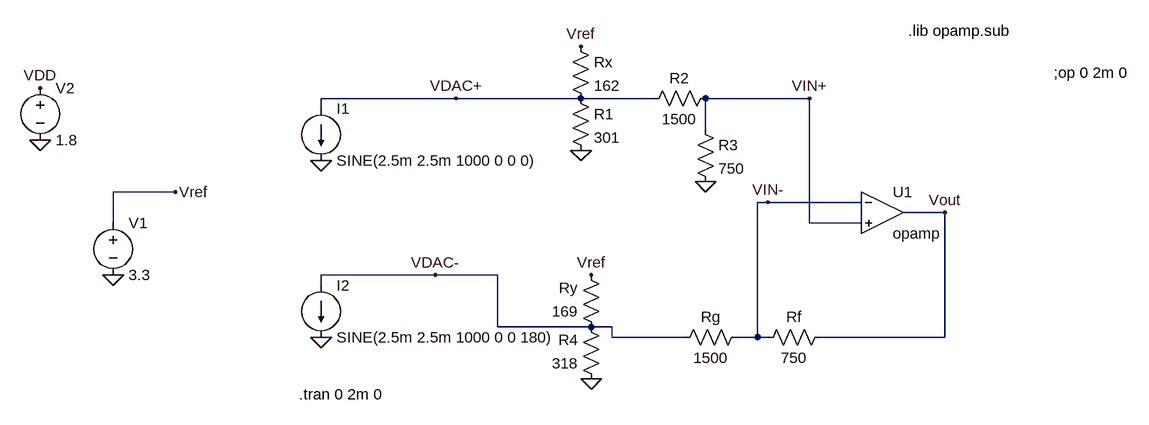
[diagram p0: schematic DAC_Network_Model.asc]
DAC_Network_Model.asc, the LTspice schematic file:
Version 4
SHEET 1 916 680
WIRE -128 16 -336 16
WIRE 64 16 -128 16
WIRE 176 16 64 16
WIRE 416 16 256 16
WIRE -336 32 -336 16
WIRE 256 64 256 16
WIRE -560 160 -656 160
WIRE 352 176 336 176
WIRE 496 176 352 176
WIRE 624 192 560 192
WIRE -656 208 -656 160
WIRE 416 208 416 16
WIRE 496 208 416 208
WIRE -160 288 -336 288
WIRE -64 288 -160 288
WIRE -336 304 -336 288
WIRE -64 368 -64 288
WIRE 80 368 -64 368
WIRE 112 368 80 368
WIRE 112 384 112 368
WIRE 224 384 112 384
WIRE 336 384 336 176
WIRE 336 384 304 384
WIRE 352 384 336 384
WIRE 624 384 624 192
WIRE 624 384 432 384
FLAG 256 144 0
FLAG 64 96 0
FLAG 80 448 0
FLAG -336 112 0
FLAG -336 384 0
FLAG -656 288 0
FLAG 64 -64 Vref
FLAG 80 288 Vref
FLAG -560 160 Vref
FLAG 624 192 Vout
FLAG -128 16 VDAC+
FLAG -160 288 VDAC-
FLAG 416 16 VIN+
FLAG 352 176 VIN-
FLAG -768 80 0
FLAG -768 0 VDD
DATAFLAG -336 288 ""
DATAFLAG -336 16 ""
SYMBOL res 48 -80 R0
SYMATTR InstName Rx
SYMATTR Value 162
SYMBOL res 48 0 R0
SYMATTR InstName R1
SYMATTR Value 301
SYMBOL res 272 0 R90
WINDOW 0 0 56 VBottom 2
WINDOW 3 32 56 VTop 2
SYMATTR InstName R2
SYMATTR Value 1500
SYMBOL res 96 464 R180
WINDOW 0 36 76 Left 2
WINDOW 3 36 40 Left 2
SYMATTR InstName R4
SYMATTR Value 318
SYMBOL res 96 384 R180
WINDOW 0 36 76 Left 2
WINDOW 3 36 40 Left 2
SYMATTR InstName Ry
SYMATTR Value 169
SYMBOL res 208 400 R270
WINDOW 0 32 56 VTop 2
WINDOW 3 0 56 VBottom 2
SYMATTR InstName Rg
SYMATTR Value 1500
SYMBOL res 336 400 R270
WINDOW 0 32 56 VTop 2
WINDOW 3 0 56 VBottom 2
SYMATTR InstName Rf
SYMATTR Value 750
SYMBOL res 240 48 R0
SYMATTR InstName R3
SYMATTR Value 750
SYMBOL Opamps\\opamp 528 128 R0
SYMATTR InstName U1
SYMBOL current -336 32 R0
WINDOW 123 0 0 Left 0
WINDOW 39 0 0 Left 0
SYMATTR InstName I1
SYMATTR Value SINE(2.5m 2.5m 1000 0 0 0)
SYMBOL current -336 304 R0
WINDOW 123 0 0 Left 0
WINDOW 39 0 0 Left 0
SYMATTR InstName I2
SYMATTR Value SINE(2.5m 2.5m 1000 0 0 180)
SYMBOL voltage -656 192 R0
WINDOW 123 0 0 Left 0
WINDOW 39 0 0 Left 0
SYMATTR InstName V1
SYMATTR Value 3.3
SYMBOL voltage -768 -16 R0
WINDOW 123 0 0 Left 0
WINDOW 39 0 0 Left 0
SYMATTR InstName V2
SYMATTR Value 1.8
TEXT -370 472 Left 2 !.tran 0 2m 0
TEXT 568 -88 Left 2 !.lib opamp.sub
TEXT 792 -24 Left 2 !;op 0 2m 0

The netlist it stands for:
* DAC_Network_Model.asc
Rx Vref VDAC+ 162
R1 VDAC+ 0 301
R2 VIN+ VDAC+ 1500
R4 0 VDAC- 318
Ry VDAC- Vref 169
Rg VDAC- VIN- 1500
Rf VIN- Vout 750
R3 VIN+ 0 750
XU1 VIN- VIN+ Vout opamp Aol=100K GBW=10Meg  ; pins invin noninvin out
I1 VDAC+ 0 SINE(2.5m 2.5m 1000 0 0 0)
I2 VDAC- 0 SINE(2.5m 2.5m 1000 0 0 180)
V1 Vref 0 3.3
V2 VDD 0 1.8
.tran 0 2m 0
.lib opamp.sub
;op 0 2m 0
.backanno
.end